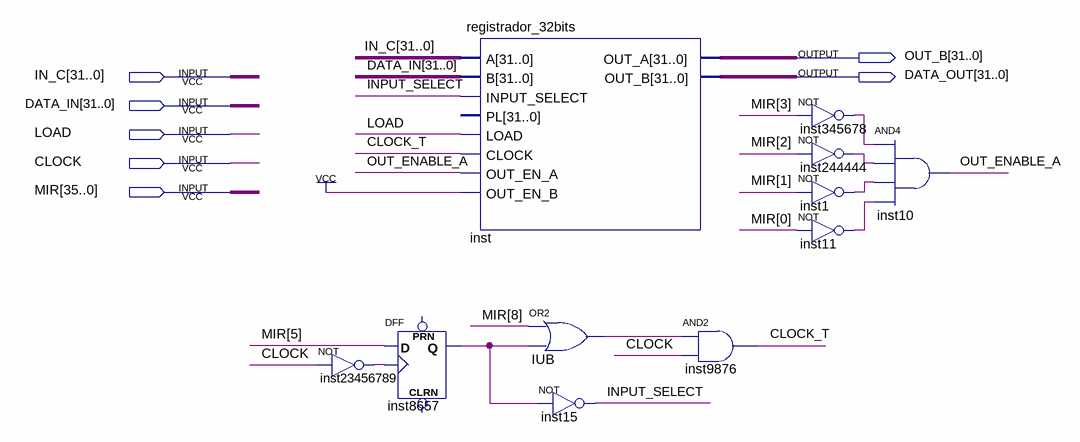
[diagram p0: schematic sheet]
// Quartus schematic MDR.bdf as structural Verilog: 11 symbols, 7 pins
module MDR (
  input  [31:0] IN_C,
  input  [31:0] DATA_IN,
  input  LOAD,
  input  CLOCK,
  input  [35:0] MIR,
  output [31:0] OUT_B,
  output [31:0] DATA_OUT
);

  wire CLOCK_T, INPUT_SELECT, inst1_out, inst11_out, inst8657_q, inst244444_out, inst345678_out,
       inst23456789_out, IUB_out, OUT_ENABLE_A;

  not inst23456789 (inst23456789_out, CLOCK);
  DFF inst8657 (.CLK(inst23456789_out), .D(MIR[5]), .Q(inst8657_q));  // open: CLRN, PRN
  registrador_32bits inst (
    .A(IN_C), .B(DATA_IN), .INPUT_SELECT(INPUT_SELECT), .LOAD(LOAD), .CLOCK(CLOCK_T),
    .OUT_EN_A(OUT_ENABLE_A), .OUT_EN_B(1'b1), .OUT_A(OUT_B), .OUT_B(DATA_OUT));  // open: PL
  or IUB (IUB_out, MIR[8], inst8657_q);
  not inst15 (INPUT_SELECT, inst8657_q);
  and inst9876 (CLOCK_T, IUB_out, CLOCK);
  not inst345678 (inst345678_out, MIR[3]);
  not inst244444 (inst244444_out, MIR[2]);
  not inst1 (inst1_out, MIR[1]);
  not inst11 (inst11_out, MIR[0]);
  and inst10 (OUT_ENABLE_A, inst345678_out, inst244444_out, inst1_out, inst11_out);
endmodule
